# Altium schematic sheet power.SchDoc
size A4
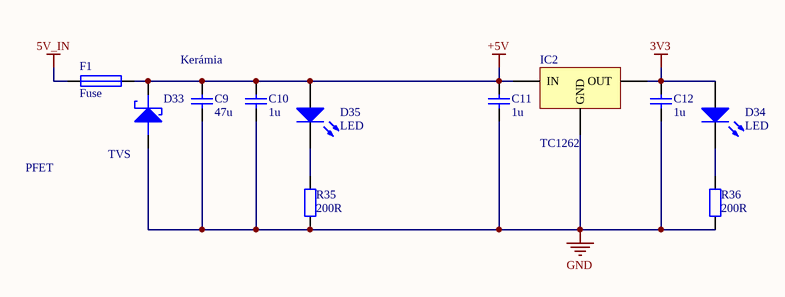
[diagram p0: power.SchDoc]

## Parts
C9  47u  [FP_0805_CAP_085]
C10  1u  [FP_0805_CAP_085]
C11  1u  [FP_0805_CAP_085]
C12  1u  [FP_0805_CAP_085]
D33  TVS  [FP_SMB]
D34  LED  [FP_0805_LED_GREEN]
D35  LED  [FP_0805_LED_GREEN]
F1  Fuse  [FP_MULTIFUSE]
IC2  TC1262  [FP_SOT223]
R35  200R  [FP_0805_RES]
R36  200R  [FP_0805_RES]

## Nets
3V3: C12.2 D34.1(A) IC2.3(OUT)
5V_IN: F1.1
+5V: C9.2 C10.2 C11.2 D33.1(CATHODE) D35.1(A) F1.2 IC2.1(IN)
GND: C9.1 C10.1 C11.1 C12.1 D33.2(ANODE) IC2.2(GND) R35.1 R36.1
NetD34_2: D34.2(K) R36.2
NetD35_2: D35.2(K) R35.2

## Notes on the sheet
- Kerámia
- PFET

## Library data of the parts
C9 = CAP: Capacitor; Reference: 1003.2847; Supplier: Hestore; Value: 47u
C10-C12 = CAP: Capacitor; Reference: 2896565; Supplier: Farnell; Value: 1u
D33 = SCHOTTKY: TVS diode; Reference: 1827607; Supplier: Farnell
D34 D35 = LED: Typical RED GaAs LED; pin to pad: 1>A 2>K; Reference: 2099239; Name: LED, green; Supplier: Farnell
F1 = Fuse: Reference: 2383301; Name: PPTC Resettable Fuse; Supplier: Farnell
IC2 = TC1262: Fixed LDO Voltage Regulator; Reference: 1852183; Supplier: Farnell
R35 R36 = RES: Resistor; Reference: 2447602; Supplier: Farnell; Value: 200R